# Altium project Курсовая_Мануков.PrjPcb
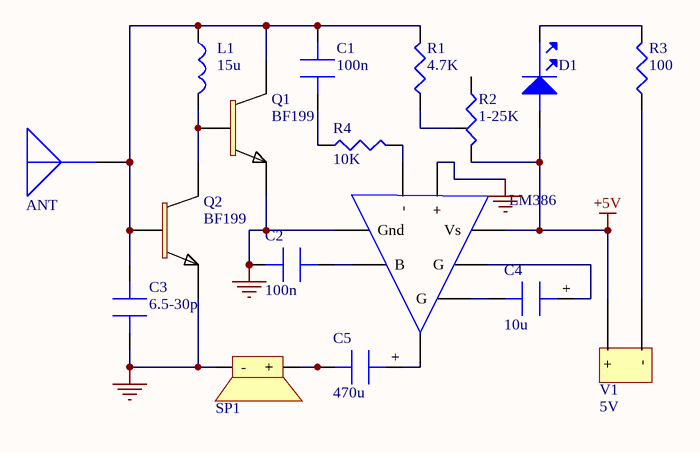
[diagram p0: Курсовая.SchDoc]
1 sheet, 17 parts. Net scope: global (net labels, ports and power ports of the same name join across sheets).
Board files: Курсовая.PcbDoc, Курсовая with dynamic.PcbDoc

## Sheet Курсовая.SchDoc
size A4

### Parts
ANT  ANT  [ANT]  (value not drawn)
C1  100n  [100n capacitor]
C2  100n  [100n capacitor]
C3  6.5-30p  [6-30pF capacitor]
C4  10u  [10uF capacitor]
C5  470u  [Capacitor 470u]
D1  LTW-M140ZVS  [LED]  (value not drawn)
L1  15u  [15uH inductor]
LM386  LM386N-3  [LM386]  (value not drawn)
Q1  BF199  [BF199]
Q2  BF199  [BF199]
R1  4.7K  [4.7K resistor]
R2  1-25K  [Potentiometer]
R3  100  [100Ohm resistor]
R4  10K  [10K resistor]
SP1  WSP-7704  [Dynamic]  (value not drawn)
V1  5V  [mini-USb port]

### Nets
+5V: D1.2 LM386.6(Vs) R2.2 V1.2(+)
GND: C2.1 C3.1 LM386.3(+) LM386.4(Gnd) Q1.3(Е) Q2.3(Е) SP1.2(-)
NetANT_1: ANT.1 C1.2 C3.2 L1.6 Q1.1(С) Q2.2(В) R1.2
NetC1_1: C1.1 R4.1
NetC2_2: C2.2 LM386.7(B)
NetC4_3: C4.3 LM386.8(G)
NetC4_+: C4.+ LM386.1(G)
NetC5_2: C5.2 C5.3 SP1.1(+)
NetC5_+: C5.+ LM386.5
NetD1_1: D1.1 R3.2
NetL1_7: L1.7 Q1.2(В) Q2.1(С)
NetLM386_2: LM386.2(-) R4.2
NetR1_1: R1.1 R2.3
NetR3_1: R3.1 V1.1(-)

Not connected (* = marked no-connect by the designer): R2 1

### Library data of the parts
C1 = CL05A104KP5NNND_1: Cap Ceramic 0.1uF 10V X5R 10% SMD 0402 85C Paper T/R; Manufacturer: Samsung; Capacitance: 100nF; Supplier 1: Digi-Key; Supplier Part Number 1: CL05A104KP5NNND-ND; Manufacturer Part Number: CL05A104KP5NNND; RoHS: Yes; Category: Ceramic Capacitors; Pricing 1: 250000=0,00182 (USD); Mount: Surface Mount; Case/Package: 0402; Min Operating Temperature: -55°C; Max Operating Temperature: 85°C; Package Quantity: 50000; Packaging: Tape and Reel; Tolerance: 10%; Voltage Rating: 10V; Dielectric: X5R; Voltage: 10V; Voltage Rating (DC): 10V; Series: CL; Construction: Flat; Length: 1mm; Width: 0.02inch; Height: 0.5mm; Thickness: 0.022inch; Depth: 0.5mm; Radiation Hardening: No; Lead Free: Lead Free; RoHS Compliant: Yes; ComponentLink1URL: https://datasheet.ciiva.com/25744/cl05a104kp5nnnd-25744885.pdf?src-supplier=Digi-Key; ComponentLink1Description: https://datasheet.ciiva.com/25744/cl05a104kp5nnnd-25744885.pdf?src-supplier=Digi-Key; ComponentLink2URL: https://datasheet.ciiva.com/26838/getdatasheetpartid-353245-26838153.pdf?src-supplier=Verical; ComponentLink2Description: https://datasheet.ciiva.com/26838/getdatasheetpartid-353245-26838153.pdf?src-supplier=Verical
C2 = CL05A104KP5NNND: Cap Ceramic 0.1uF 10V X5R 10% SMD 0402 85C Paper T/R; Manufacturer: Samsung; Capacitance: 100nF; Supplier 1: Digi-Key; Supplier Part Number 1: CL05A104KP5NNND-ND; Manufacturer Part Number: CL05A104KP5NNND; RoHS: Yes; Category: Ceramic Capacitors; Pricing 1: 250000=0,00182 (USD); Mount: Surface Mount; Case/Package: 0402; Min Operating Temperature: -55°C; Max Operating Temperature: 85°C; Package Quantity: 50000; Packaging: Tape and Reel; Tolerance: 10%; Voltage Rating: 10V; Dielectric: X5R; Voltage: 10V; Voltage Rating (DC): 10V; Series: CL; Construction: Flat; Length: 1mm; Width: 0.02inch; Height: 0.5mm; Thickness: 0.022inch; Depth: 0.5mm; Radiation Hardening: No; Lead Free: Lead Free; RoHS Compliant: Yes; ComponentLink1URL: https://datasheet.ciiva.com/25744/cl05a104kp5nnnd-25744885.pdf?src-supplier=Digi-Key; ComponentLink1Description: https://datasheet.ciiva.com/25744/cl05a104kp5nnnd-25744885.pdf?src-supplier=Digi-Key; ComponentLink2URL: https://datasheet.ciiva.com/26838/getdatasheetpartid-353245-26838153.pdf?src-supplier=Verical; ComponentLink2Description: https://datasheet.ciiva.com/26838/getdatasheetpartid-353245-26838153.pdf?src-supplier=Verical
C3 = GKG30086-05: Cap Trimmer SMD; Manufacturer: Sprague Goodman; Supplier 1: Digi-Key; Supplier Part Number 1: SG9122CT-ND; Manufacturer Part Number: GKG30086-05; RoHS: Yes; Category: Trimmer / Variable Capacitors; Stock 1: 3567; Pricing 1: 1=1,64000, 10=1,59900, 50=1,56820 (USD)
C4 = 106CKE063M: Aluminum Electrolytic Capacitors - Radial Leaded 10uF 63 Volts 20% LYTICS/IC; Manufacturer: CDE Illinois Capacitor; Voltage Rating: 63V; ESR (Equivalent Series Resistance): 14.9208R; Polarity: Polar; Ripple Current: 60mA; Life (Hours): 2000Hour; Supplier 1: Digi-Key; Supplier Part Number 1: 106CKE063M-ND; Manufacturer Part Number: 106CKE063M; RoHS: Yes; Category: Aluminum Electrolytic Capacitors; Pricing 1: 10000=0,03278 (USD); Mount: Through Hole; Case/Package: Radial; Min Operating Temperature: -40°C; Max Operating Temperature: 105°C; Package Quantity: 1000; Packaging: Bulk; Capacitance: 10uF; Tolerance: 20%; Lead Pitch: 0.079inch; Height - Seated (Max): 0.492inch; RoHS Compliant: Yes; ComponentLink1URL: http://www.illinoiscapacitor.com/pdf/seriesDocuments/CKH_CKE%20series.pdf?src-supplier=Digi-Key; ComponentLink1Description: http://www.illinoiscapacitor.com/pdf/seriesDocuments/CKH_CKE%20series.pdf?src-supplier=Digi-Key
C5 = ECA-0JHG471B: Cap Aluminum 470uF 6.3V 20% (6.3 X 11.2mm) Radial 5mm 230mA 1000 hr 105C Ammo Pack; Manufacturer: Panasonic; Life (Hours): 1000Hour; Lead/Base Style: Straight; Supplier 1: Digi-Key; Supplier Part Number 1: ECA-0JHG471B-ND; Manufacturer Part Number: ECA-0JHG471B; RoHS: Yes; Category: Aluminum Electrolytic Capacitors; Pricing 1: 4000=0,07820 (USD); Mount: Through Hole; Case/Package: Radial; Min Operating Temperature: -55°C; Max Operating Temperature: 105°C; Package Quantity: 2000; Capacitance: 470uF; Voltage Rating (DC): 6.3V; Tolerance: 20%; Ripple Current: 230mA; Voltage Rating: 6.3V; Packaging: Tape and Reel; Termination: Radial; Diameter: 6.3mm; Length: 11.2mm; Height: 11.2mm; Lead Pitch: 5mm; Height - Seated (Max): 0.48inch; Radiation Hardening: No; ComponentLink1URL: https://datasheet.ciiva.com/24067/a-e-461514-24067782.pdf?src-supplier=Mouser; ComponentLink1Description: https://datasheet.ciiva.com/24067/a-e-461514-24067782.pdf?src-supplier=Mouser; ComponentLink2URL: https://datasheet.ciiva.com/106/aba0000ce26-106251.pdf?src-supplier=Digi-Key; ComponentLink2Description: https://datasheet.ciiva.com/106/aba0000ce26-106251.pdf?src-supplier=Digi-Key; ComponentLink3URL: https://datasheet.ciiva.com/11680/aba0000ce26-11680205.pdf?src-supplier=Avnet; ComponentLink3Description: https://datasheet.ciiva.com/11680/aba0000ce26-11680205.pdf?src-supplier=Avnet
D1 = LTW-M140ZVS: White 120° Viewing Angle 3 x 1.05 x 1.2 mm 3.5 V 20 mA Surface Mount Lamp; Manufacturer: Vishay Lite-On; Lens Color: Yellow; Forward Current: 20mA; Forward Voltage: 3.2V; Lens Style: Rectangular; Max Current Rating: 100mA; Supplier 1: Mouser; Supplier Part Number 1: 859-LTW-M140ZVS; Manufacturer Part Number: LTW-M140ZVS; RoHS: Yes; Category: LEDs; Stock 1: 14030; Pricing 1: 1=0,45000, 10=0,25000, 50=0,25000, 100=0,11500, 1000=0,08300, 10000=0,05800 (USD); Case/Package: SMD/SMT; Color: White; Min Operating Temperature: -30°C; Max Operating Temperature: 85°C; Viewing Angle: 120°; Illumination Color: White; Packaging: Tape and Reel; Package Quantity: 2000; Correlated Color Temperature (CCT): -; Test Current: 20mA; Orientation: Top View; Length: 3mm; Width: 1.4mm; RoHS Compliant: Yes; ComponentLink1URL: https://datasheet.ciiva.com/29560/ltw-m140zvs-29560007.pdf?src-supplier=Digi-Key; ComponentLink1Description: https://datasheet.ciiva.com/29560/ltw-m140zvs-29560007.pdf?src-supplier=Digi-Key; ComponentLink2URL: https://datasheet.ciiva.com/24120/ltw-m140zvs-267545-24120598.pdf?src-supplier=Mouser; ComponentLink2Description: https://datasheet.ciiva.com/24120/ltw-m140zvs-267545-24120598.pdf?src-supplier=Mouser
L1 = 78F150J-RC: BOURNS JW MILLER   78F150J-RC   CHOKE, 15UH, 150MA, 5%, 16MHZ; Core Material: Ferrite; Q Factor: 50; Current Rating: 335mA; Shielding: Unshielded; DC Resistance (DCR): 930mR; Test Frequency: 2.5MHz; Lead/Base Style: Axial; Lead Diameter: 0.51mm; Supplier 1: Mouser; Supplier Part Number 1: 542-78F150J-RC; Manufacturer: Bourns JW Miller; Manufacturer Part Number: 78F150J-RC; RoHS: Yes; Category: Fixed Inductors; Stock 1: 2871; Pricing 1: 1=0,21000, 10=0,15600, 50=0,14200, 100=0,13900, 1000=0,09100, 10000=0,07900 (USD); Mount: Through Hole; Case/Package: Axial; Contact Plating: Tin; Min Operating Temperature: -55°C; Max Operating Temperature: 105°C; Inductance Tolerance: 5%; Self Resonant Frequency: 16MHz; Tolerance: 5%; Package Quantity: 5000; Packaging: Bag; Resistor Type: Wirewound; Inductance: 15uH; Max DC Current: 335mA; Termination: Axial; DC Current: 335mA; Series: 78F; Diameter: 2.79mm; Length: 7.11mm; REACH SVHC: No SVHC; Military Standard: Not; RoHS Compliant: Yes; ComponentLink1URL: https://datasheet.ciiva.com/8105/78f-series-8105197.pdf?src-supplier=Avnet; ComponentLink1Description: https://datasheet.ciiva.com/8105/78f-series-8105197.pdf?src-supplier=Avnet; ComponentLink2URL: https://datasheet.ciiva.com/1474/78f-series-1474693.pdf?src-supplier=Element14; ComponentLink2Description: https://datasheet.ciiva.com/1474/78f-series-1474693.pdf?src-supplier=Element14; ComponentLink3URL: https://datasheet.ciiva.com/6703/78f-series-6703437.pdf?src-supplier=Digi-Key; ComponentLink3Description: https://datasheet.ciiva.com/6703/78f-series-6703437.pdf?src-supplier=Digi-Key
LM386 = LM386N-3: Audio Amp Speaker 1-CH Mono 0.7W Class-AB 8-Pin PDIP Rail; Manufacturer: TI National Semiconductor; Voltage Gain: 46dB; Min Supply Voltage: 4V; Max Supply Voltage: 12V; Number of Channels: 1; Output Power: 1W; Unity Gain Bandwidth Product: 300kHz; Max Power Dissipation: 1.25W; Nominal Supply Current: 4mA; Max Output Power: 700mW; Power Supply Rejection Ratio (PSRR): 50dB; Input Bias Current: 250nA; Quiescent Current: 8mA; Input Offset Voltage (Vos): 2.5mV; Supply Type: Single; Load Impedance: 8R; Amplifier Type: POWER; Supplier 1: Digi-Key; Supplier Part Number 1: 2156-LM386N-3-ND; Manufacturer Part Number: LM386N-3; RoHS: No; Category: Amplifiers - Audio; Case/Package: P; Number of Pins: 8; Weight: 0.5lb; Min Operating Temperature: 0°C; Max Operating Temperature: 70°C; Packaging: Rail/Tube; Package Quantity: 40; Bandwidth: 300kHz; Power Dissipation: 1.25W; Number of Amplifiers: 1; Gain Bandwidth Product: 300kHz; Series: LM386; Supply Current: 4mA; Length: 9.27mm; Width: 6.35mm; Height: 3.3mm; Radiation Hardening: No; REACH SVHC: No SVHC; Lead Free: Contains Lead; RoHS Compliant: No; ComponentLink1URL: https://datasheet.ciiva.com/2968/lm386-2968336.pdf?src-supplier=Avnet; ComponentLink1Description: https://datasheet.ciiva.com/2968/lm386-2968336.pdf?src-supplier=Avnet; ComponentLink2URL: https://datasheet.ciiva.com/15131/getdatasheetpartid-186304-15131754.pdf?src-supplier=Verical; ComponentLink2Description: https://datasheet.ciiva.com/15131/getdatasheetpartid-186304-15131754.pdf?src-supplier=Verical; ComponentLink3URL: https://datasheet.ciiva.com/26842/lm386n-3-26842542.pdf?src-supplier=IIIC; ComponentLink3Description: https://datasheet.ciiva.com/26842/lm386n-3-26842542.pdf?src-supplier=IIIC; ComponentLink4URL: https://datasheet.ciiva.com/1480/1640767-1480995.pdf?src-supplier=Element14; ComponentLink4Description: https://datasheet.ciiva.com/1480/1640767-1480995.pdf?src-supplier=Element14; ComponentLink5URL: https://datasheet.ciiva.com/6625/lm386-6625686.pdf?src-supplier=Digi-Key; ComponentLink5Description: https://datasheet.ciiva.com/6625/lm386-6625686.pdf?src-supplier=Digi-Key
Q1 Q2 = BF199: TRANSISTOR RF NPN 25V 50MA TO-92; Manufacturer: ON Semiconductor / Fairchild; Transition Frequency: 1.1GHz; Max Power Dissipation: 350mW; Emitter Base Voltage (VEBO): 4V; Number of Elements: 1; Collector Base Voltage (VCBO): 40V; hFE Min: 38; Element Configuration: Single; Supplier 1: Digi-Key; Manufacturer Part Number: BF199; RoHS: No; Category: BJTs; Mount: Through Hole; Case/Package: TO-92; Number of Pins: 3; Weight: 0.202g; Min Operating Temperature: -55°C; Max Operating Temperature: 150°C; Voltage Rating (DC): 25V; Collector Emitter Voltage (VCEO): 25V; Current Rating: 50mA; Max Collector Current: 50mA; Power Dissipation: 350mW; Continuous Collector Current: 50mA; Polarity: NPN; Collector Emitter Breakdown Voltage: 25V; Packaging: Bulk; Package Quantity: 2000; Frequency: 1.1GHz; Max Frequency: 1.1GHz; Gain Bandwidth Product: 1.1GHz; REACH SVHC: No SVHC; Lead Free: Lead Free; ComponentLink1URL: https://datasheet.ciiva.com/965/bf199-965939.pdf?src-supplier=Digi-Key; ComponentLink1Description: https://datasheet.ciiva.com/965/bf199-965939.pdf?src-supplier=Digi-Key; ComponentLink2URL: https://datasheet.ciiva.com/1196/200356-1196561.pdf?src-supplier=Element14; ComponentLink2Description: https://datasheet.ciiva.com/1196/200356-1196561.pdf?src-supplier=Element14; ComponentLink3URL: https://datasheet.ciiva.com/1196/200356-1196562.pdf?src-supplier=Element14; ComponentLink3Description: https://datasheet.ciiva.com/1196/200356-1196562.pdf?src-supplier=Element14; ComponentLink4URL: https://datasheet.ciiva.com/1217/200356-1217723.pdf?src-supplier=Farnell; ComponentLink4Description: https://datasheet.ciiva.com/1217/200356-1217723.pdf?src-supplier=Farnell; Supplier Part Number 1: BF199FS-ND
R1 = SG731JTTD472M: Thick Film Resistors - SMD 0.1W 4.7Kohm 20% 200ppm; Manufacturer: KOA Speer; Power Rating: 100mW; Resistance: 4.7kR; Voltage Rating: 50V; Temperature Coefficient: 200ppm/°C; Supplier 1: Digi-Key; Supplier Part Number 1: 2019-SG731JTTD472MTR-ND; Manufacturer Part Number: SG731JTTD472M; RoHS: Yes; Category: Chip SMD Resistors; Pricing 1: 5000=0,01564 (USD); Case/Package: 0603; Case Code (Imperial): 0603; Case Code (Metric): 1608; Min Operating Temperature: -55°C; Max Operating Temperature: 155°C; Packaging: Tape and Reel; Package Quantity: 5000; Tolerance: 20%; Resistor Type: Thick Film; Termination: SMD/SMT; Voltage Rating (DC): 50V; Series: SG73; Length: 1.6mm; Width: 0.8mm; Height: 0.45mm; RoHS Compliant: Yes; ComponentLink1URL: http://www.koaspeer.com/catimages/Products/SG73/SG73.pdf?src-supplier=Mouser; ComponentLink1Description: http://www.koaspeer.com/catimages/Products/SG73/SG73.pdf?src-supplier=Mouser
R2 = CB6MH253M: Res Carbon Film Trimmer 25K Ohm 20% 0.15W 1(Elec)/1(Mech)Turn (9.8 X 5 X 12.1mm) Pin Thru-Hole; Manufacturer: TE Connectivity Citec; Resistance: 25kR; Power Rating: 100mW; Sealable: No (Without); Supplier 1: Digi-Key; Supplier Part Number 1: CB6MH253M-ND; Manufacturer Part Number: CB6MH253M; RoHS: Yes; Category: Variable Resistors and Potentiometers; Pricing 1: 1000=0,62682 (USD); Mount: Radial; Tolerance: 20%; ELV: Compliant; RoHS Compliant: Yes
R3 = SR0805MR-7W100RL: Res 100 Ohm 20% 1/4W 0805; Manufacturer: Yageo; Max Power Dissipation: 250mW; Temperature Coefficient: 200ppm/°C; Resistance: 100R; Supplier 1: Digi-Key; Supplier Part Number 1: SR0805MR-7W100RL-ND; Manufacturer Part Number: SR0805MR-7W100RL; RoHS: Yes; Category: Chip SMD Resistors; Pricing 1: 5000=0,02251 (USD); Case/Package: 0805; Min Operating Temperature: -55°C; Max Operating Temperature: 155°C; Features: Automotive AEC-Q200; Tolerance: 20%; Packaging: Tape and Reel; Resistor Type: Thick Film; Number of Terminations: 2; Length: 0.079inch; Width: 0.049inch; Height: 0.024inch; ComponentLink1URL: http://www.yageo.com/documents/recent/PYu-SR_20105_RoHS_L_5.pdf?src-supplier=Digi-Key; ComponentLink1Description: http://www.yageo.com/documents/recent/PYu-SR_20105_RoHS_L_5.pdf?src-supplier=Digi-Key
R4 = FCR0603MT10K0: Res Thick Film 0603 10kOhm 20% 1/10W ±200ppm/°C Molded Paper T/R; Manufacturer: Stackpole Electronics; Supplier 1: Digi-Key; Supplier Part Number 1: FCR0603MT10K0-ND; Manufacturer Part Number: FCR0603MT10K0; Pricing 1: 5000=0,01250 (USD); RoHS Compliant: Yes; ComponentLink1URL: http://datasheet.octopart.com/FCR0603MT10K0-Stackpole-Electronics-datasheet-141158313.pdf?src-supplier=Stackpole+Electronics; ComponentLink1Description: http://datasheet.octopart.com/FCR0603MT10K0-Stackpole-Electronics-datasheet-141158313.pdf?src-supplier=Stackpole+Electronics
SP1 = WSP-7704: Manufacturer: Soberton; Shape: Rectangular,Round; Sensing Method: Magnetic; Self Resonant Frequency: 330Hz; Impedance: 4R; Power Rating: 3W; Max Power Dissipation: 4W; Ratings: IP65,Waterproof,Dust Tight; Supplier 1: Digi-Key; Supplier Part Number 1: 433-1182-ND; Manufacturer Part Number: WSP-7704; RoHS: Yes; Stock 1: 1122; Pricing 1: 1=3,48000, 10=2,87400, 25=2,65240, 40=2,49075, 100=2,33570, 500=2,06150 (USD); Type: General Purpose; Packaging: Tray; Termination: Solder; ComponentLink1URL: http://cirlw3yrzg4afc1x47lv2k18.wpengine.netdna-cdn.com/wp-content/uploads/2017/12/WSP-7704.pdf?src-supplier=Digi-Key; ComponentLink1Description: http://cirlw3yrzg4afc1x47lv2k18.wpengine.netdna-cdn.com/wp-content/uploads/2017/12/WSP-7704.pdf?src-supplier=Digi-Key; Category: Speakers
V1 = M701-340542: USB Connectors MINI USB SINGLE SMT 5P HORIZONTAL; Manufacturer: Harwin; Number of Terminals/Pins: 5; Max Current Rating: 1A; Gender: Receptacle; Connector Type: USB,Receptacle; Number of Ports: 1; Insulation Resistance: 100MR; Pitch: 0.8mm; Supplier 1: Digi-Key; Supplier Part Number 1: 952-2197-ND; Manufacturer Part Number: M701-340542; RoHS: Yes; Category: Connectors; Stock 1: 89; Pricing 1: 1=1,23000, 10=1,07900, 25=1,01520, 50=0,97300, 100=0,93060, 250=0,84600, 500=0,76140, 1000=0,67680, 2500=0,61335 (USD); Mount: Surface Mount,Horizontal; Contact Plating: Gold; Color: Black; Contact Material: Bronze; Housing Material: Polymer; Min Operating Temperature: -55°C; Max Operating Temperature: 105°C; Package Quantity: 68; Packaging: Bulk; Current Rating: 1A; Number of Contacts: 5; Number of Positions: 5; Termination: Solder; Orientation: Right Angle; Series: M701; Length: 9.9mm; Depth: 9.3mm; RoHS Compliant: Yes; ComponentLink1URL: https://datasheet.ciiva.com/4599/m701-340542-53541-4599048.pdf?src-supplier=Mouser; ComponentLink1Description: https://datasheet.ciiva.com/4599/m701-340542-53541-4599048.pdf?src-supplier=Mouser; ComponentLink2URL: https://datasheet.ciiva.com/3095/m701-340542-3095669.pdf?src-supplier=Avnet; ComponentLink2Description: https://datasheet.ciiva.com/3095/m701-340542-3095669.pdf?src-supplier=Avnet